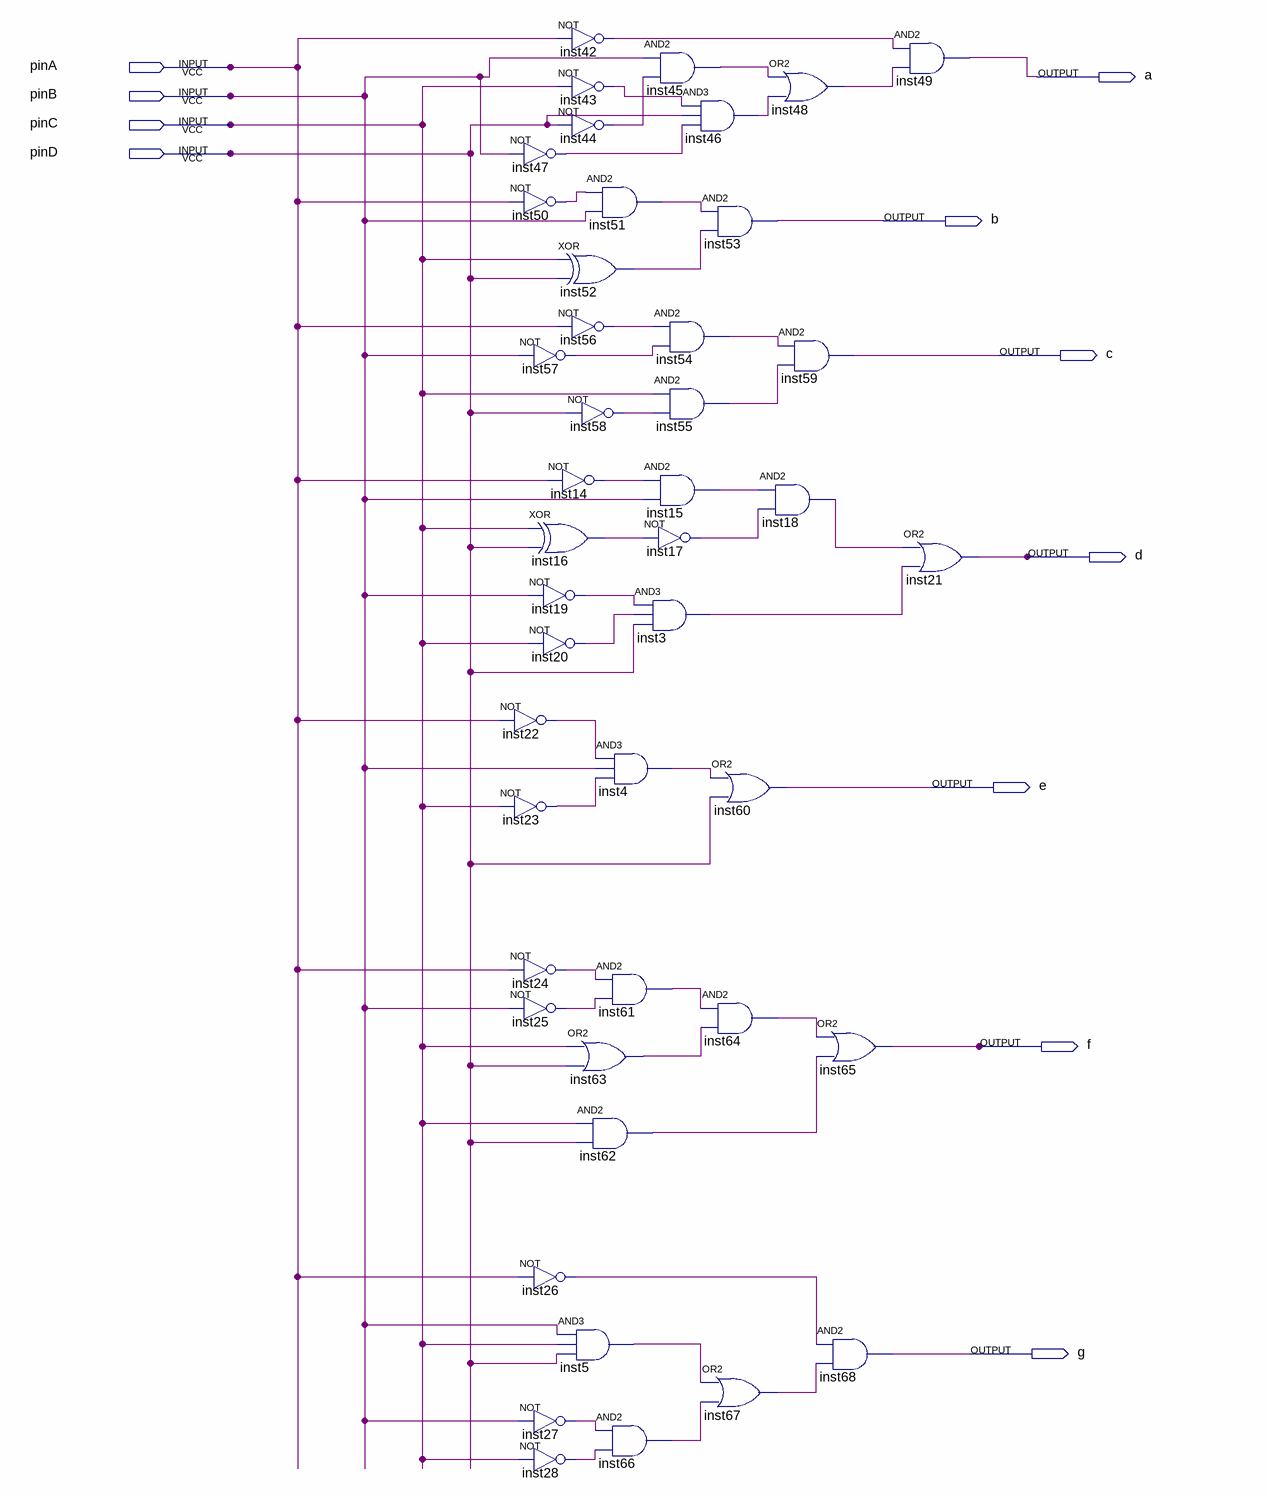
[diagram p0: schematic sheet]
// Quartus schematic decodificadorBCD.bdf as structural Verilog: 45 symbols, 11 pins
module decodificadorBCD (
  input  pinA,
  input  pinB,
  input  pinC,
  input  pinD,
  output a,
  output b,
  output c,
  output d,
  output e,
  output f,
  output g
);

  wire inst3_out, inst4_out, inst5_out, inst14_out, inst15_out, inst16_out, inst17_out, inst18_out,
       inst19_out, inst20_out, inst22_out, inst23_out, inst24_out, inst25_out, inst26_out, inst27_out,
       inst28_out, inst42_out, inst43_out, inst44_out, inst45_out, inst46_out, inst47_out, inst48_out,
       inst50_out, inst51_out, inst52_out, inst54_out, inst55_out, inst56_out, inst57_out, inst58_out,
       inst61_out, inst62_out, inst63_out, inst64_out, inst66_out, inst67_out;

  not inst47 (inst47_out, pinB);
  not inst50 (inst50_out, pinA);
  not inst57 (inst57_out, pinB);
  xor inst16 (inst16_out, pinC, pinD);
  not inst19 (inst19_out, pinB);
  not inst20 (inst20_out, pinC);
  not inst22 (inst22_out, pinA);
  not inst23 (inst23_out, pinC);
  not inst24 (inst24_out, pinA);
  not inst25 (inst25_out, pinB);
  not inst26 (inst26_out, pinA);
  not inst27 (inst27_out, pinB);
  not inst28 (inst28_out, pinC);
  not inst42 (inst42_out, pinA);
  not inst43 (inst43_out, pinC);
  not inst44 (inst44_out, pinD);
  and inst51 (inst51_out, inst50_out, pinB);
  xor inst52 (inst52_out, pinC, pinD);
  not inst56 (inst56_out, pinA);
  not inst58 (inst58_out, pinD);
  not inst14 (inst14_out, pinA);
  and inst4 (inst4_out, inst22_out, pinB, inst23_out);
  and inst61 (inst61_out, inst24_out, inst25_out);
  or inst63 (inst63_out, pinC, pinD);
  and inst62 (inst62_out, pinC, pinD);
  and inst5 (inst5_out, pinB, pinC, pinD);
  and inst66 (inst66_out, inst27_out, inst28_out);
  and inst45 (inst45_out, pinB, inst44_out);
  and inst46 (inst46_out, inst43_out, pinD, inst47_out);
  and inst54 (inst54_out, inst56_out, inst57_out);
  and inst55 (inst55_out, pinC, inst58_out);
  and inst15 (inst15_out, inst14_out, pinB);
  not inst17 (inst17_out, inst16_out);
  and inst3 (inst3_out, inst19_out, inst20_out, pinD);
  or inst48 (inst48_out, inst45_out, inst46_out);
  and inst53 (b, inst51_out, inst52_out);
  and inst18 (inst18_out, inst15_out, inst17_out);
  or inst60 (e, inst4_out, pinD);
  and inst64 (inst64_out, inst61_out, inst63_out);
  or inst67 (inst67_out, inst5_out, inst66_out);
  and inst59 (c, inst54_out, inst55_out);
  or inst65 (f, inst64_out, inst62_out);
  and inst68 (g, inst26_out, inst67_out);
  and inst49 (a, inst42_out, inst48_out);
  or inst21 (d, inst18_out, inst3_out);
endmodule
